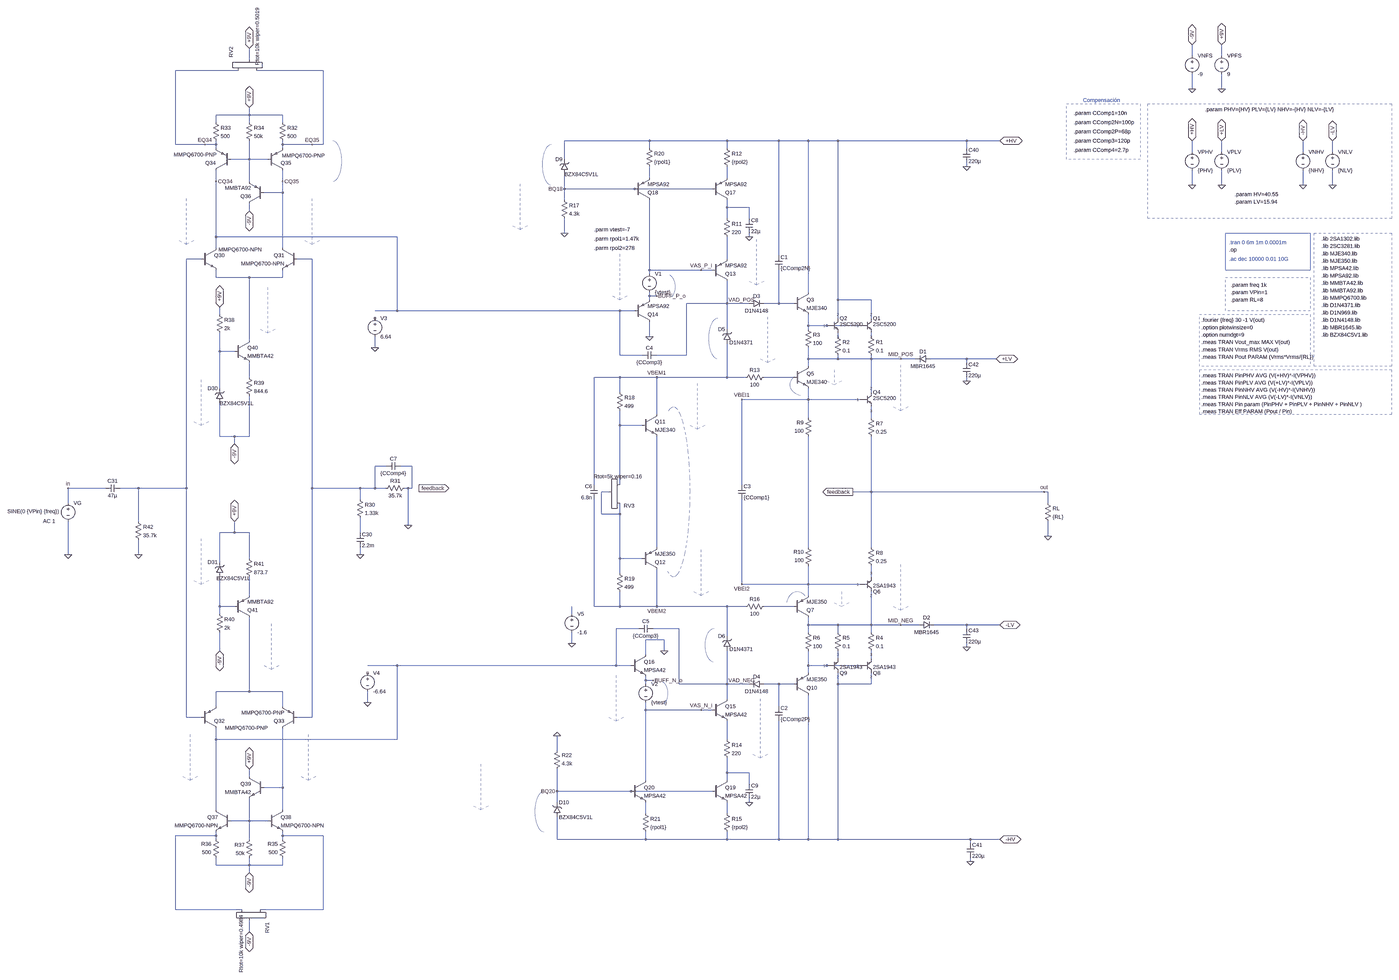
[diagram p0: schematic amplifier_V0.6_UGLY.asc, whole sheet]
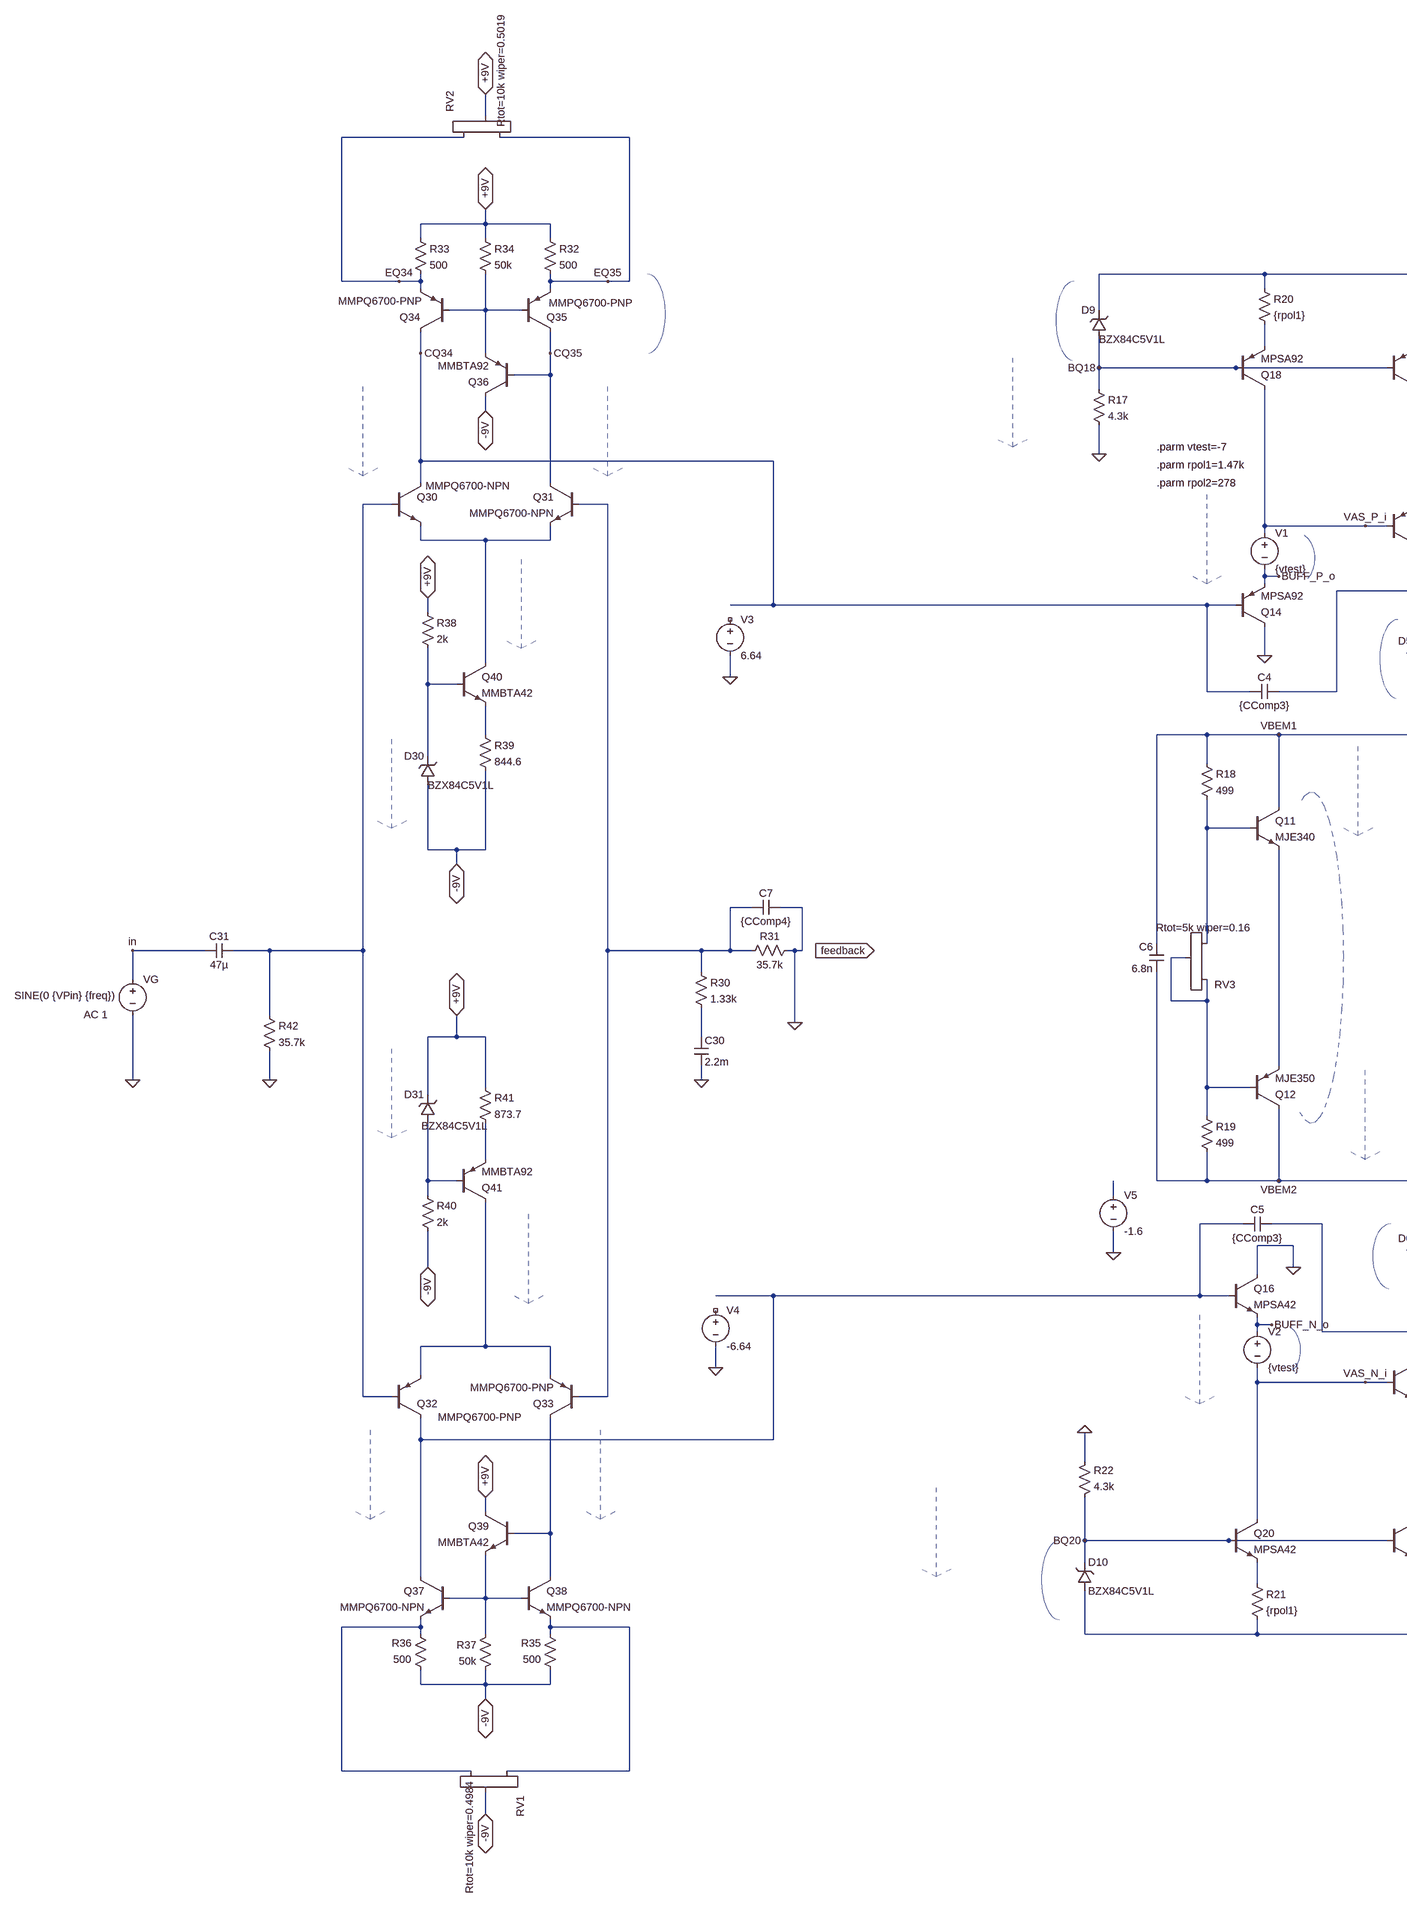
[diagram p1: schematic amplifier_V0.6_UGLY.asc, part, row 1 of 1, column 1 of 2]
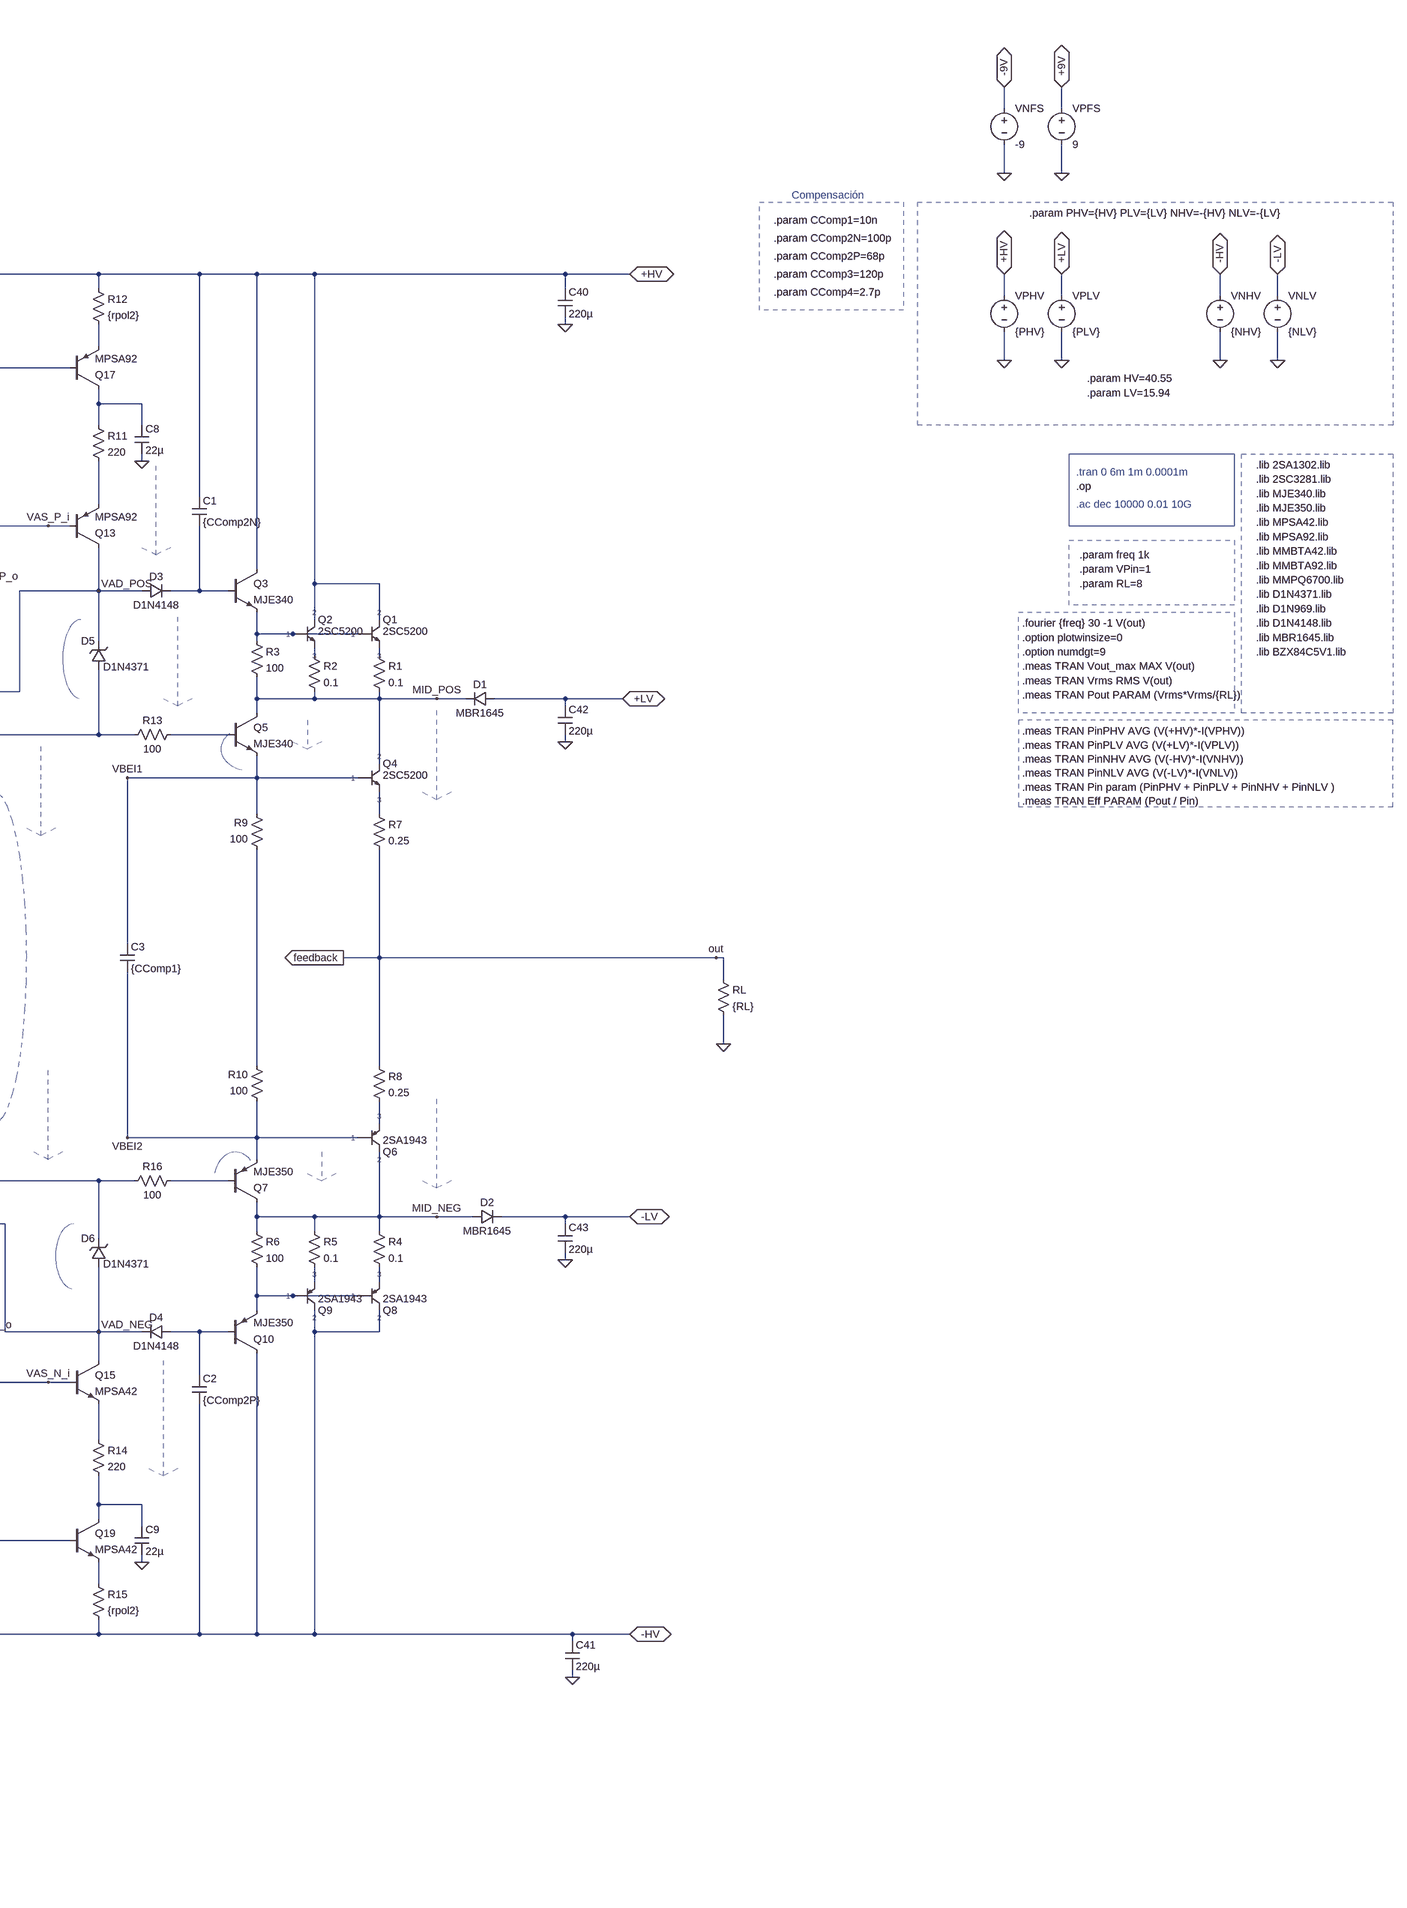
[diagram p2: schematic amplifier_V0.6_UGLY.asc, part, row 1 of 1, column 2 of 2]
amplifier_V0.6_UGLY.asc, the LTspice schematic file:
Version 4
SHEET 1 4212 2324
WIRE 1936 -1760 1936 -1808
WIRE 2064 -1760 2064 -1808
WIRE -2704 -1744 -2704 -1792
WIRE -2752 -1696 -3024 -1696
WIRE -2384 -1696 -2672 -1696
WIRE 1936 -1616 1936 -1680
WIRE 2064 -1616 2064 -1680
WIRE -2704 -1504 -2704 -1536
WIRE -2704 -1504 -2848 -1504
WIRE -2560 -1504 -2704 -1504
WIRE -2848 -1472 -2848 -1504
WIRE -2704 -1472 -2704 -1504
WIRE -2560 -1472 -2560 -1504
WIRE -640 -1392 -1008 -1392
WIRE -304 -1392 -640 -1392
WIRE -80 -1392 -304 -1392
WIRE 48 -1392 -80 -1392
WIRE 176 -1392 48 -1392
WIRE 960 -1392 176 -1392
WIRE 1104 -1392 960 -1392
WIRE -3024 -1376 -3024 -1696
WIRE -2896 -1376 -3024 -1376
WIRE -2848 -1376 -2848 -1392
WIRE -2848 -1376 -2896 -1376
WIRE -2560 -1376 -2560 -1392
WIRE -2432 -1376 -2560 -1376
WIRE -2384 -1376 -2384 -1696
WIRE -2384 -1376 -2432 -1376
WIRE -2848 -1360 -2848 -1376
WIRE -2560 -1360 -2560 -1376
WIRE -640 -1360 -640 -1392
WIRE -304 -1360 -304 -1392
WIRE 960 -1360 960 -1392
WIRE 1936 -1344 1936 -1392
WIRE 2064 -1344 2064 -1392
WIRE 2416 -1344 2416 -1392
WIRE 2544 -1344 2544 -1392
WIRE -2704 -1312 -2704 -1392
WIRE -2704 -1312 -2784 -1312
WIRE -2624 -1312 -2704 -1312
WIRE -1008 -1312 -1008 -1392
WIRE 960 -1280 960 -1296
WIRE -640 -1232 -640 -1280
WIRE -304 -1232 -304 -1280
WIRE -2848 -1216 -2848 -1264
WIRE -2704 -1216 -2704 -1312
WIRE -2560 -1216 -2560 -1264
WIRE 1936 -1200 1936 -1264
WIRE 2064 -1200 2064 -1264
WIRE 2416 -1200 2416 -1264
WIRE 2544 -1200 2544 -1264
WIRE -1008 -1184 -1008 -1248
WIRE -704 -1184 -1008 -1184
WIRE -368 -1184 -704 -1184
WIRE -2560 -1168 -2560 -1216
WIRE -2560 -1168 -2640 -1168
WIRE -1008 -1136 -1008 -1184
WIRE -304 -1104 -304 -1136
WIRE -208 -1104 -304 -1104
WIRE -2704 -1088 -2704 -1120
WIRE -304 -1056 -304 -1104
WIRE -208 -1056 -208 -1104
WIRE -1008 -992 -1008 -1056
WIRE -2848 -976 -2848 -1216
WIRE -2064 -976 -2848 -976
WIRE -208 -976 -208 -992
WIRE -2848 -928 -2848 -976
WIRE -2560 -928 -2560 -1168
WIRE -80 -896 -80 -1392
WIRE -2912 -880 -2976 -880
WIRE -2432 -880 -2496 -880
WIRE -304 -880 -304 -976
WIRE -640 -832 -640 -1136
WIRE -416 -832 -640 -832
WIRE -368 -832 -416 -832
WIRE -640 -816 -640 -832
WIRE -2848 -800 -2848 -832
WIRE -2704 -800 -2848 -800
WIRE -2560 -800 -2560 -832
WIRE -2560 -800 -2704 -800
WIRE 48 -736 48 -1392
WIRE -640 -720 -640 -736
WIRE -608 -720 -640 -720
WIRE -640 -704 -640 -720
WIRE 176 -704 176 -1392
WIRE 320 -704 176 -704
WIRE -304 -688 -304 -784
WIRE -304 -688 -480 -688
WIRE -208 -688 -304 -688
WIRE -80 -688 -80 -832
WIRE -80 -688 -144 -688
WIRE -16 -688 -80 -688
WIRE -2064 -656 -2064 -976
WIRE -2064 -656 -2160 -656
WIRE -768 -656 -2064 -656
WIRE -704 -656 -768 -656
WIRE -2832 -640 -2832 -672
WIRE 176 -624 176 -704
WIRE 320 -624 320 -704
WIRE 48 -592 48 -640
WIRE 128 -592 48 -592
WIRE 272 -592 128 -592
WIRE -304 -576 -304 -688
WIRE 48 -576 48 -592
WIRE -640 -544 -640 -608
WIRE 176 -544 176 -560
WIRE 320 -544 320 -560
WIRE -2704 -528 -2704 -800
WIRE -2160 -496 -2160 -544
WIRE -2832 -480 -2832 -560
WIRE -2768 -480 -2832 -480
WIRE -768 -464 -768 -656
WIRE -672 -464 -768 -464
WIRE -480 -464 -480 -688
WIRE -480 -464 -608 -464
WIRE 48 -448 48 -496
WIRE 176 -448 176 -464
WIRE 176 -448 48 -448
WIRE 320 -448 320 -464
WIRE 320 -448 176 -448
WIRE 448 -448 320 -448
WIRE 512 -448 448 -448
WIRE 960 -448 576 -448
WIRE 1088 -448 960 -448
WIRE 960 -432 960 -448
WIRE 48 -416 48 -448
WIRE -2704 -368 -2704 -432
WIRE -768 -368 -880 -368
WIRE -608 -368 -768 -368
WIRE -304 -368 -304 -512
WIRE -304 -368 -608 -368
WIRE -224 -368 -304 -368
WIRE -16 -368 -144 -368
WIRE 960 -352 960 -368
WIRE -2832 -320 -2832 -480
WIRE -768 -304 -768 -368
WIRE 320 -304 320 -448
WIRE 48 -272 48 -320
WIRE 48 -272 -240 -272
WIRE 272 -272 48 -272
WIRE -608 -208 -608 -368
WIRE 48 -192 48 -272
WIRE 320 -192 320 -240
WIRE -768 -160 -768 -224
WIRE -672 -160 -768 -160
WIRE -2832 -112 -2832 -256
WIRE -2768 -112 -2832 -112
WIRE -2704 -112 -2704 -288
WIRE -2704 -112 -2768 -112
WIRE -2768 -80 -2768 -112
WIRE -2112 16 -2160 16
WIRE -2000 16 -2048 16
WIRE -880 96 -880 -368
WIRE -768 96 -768 -160
WIRE -240 96 -240 -272
WIRE -3328 112 -3600 112
WIRE -3184 112 -3264 112
WIRE -2976 112 -2976 -880
WIRE -2976 112 -3184 112
WIRE -2432 112 -2432 -880
WIRE -2224 112 -2432 112
WIRE -2160 112 -2160 16
WIRE -2160 112 -2224 112
WIRE -2112 112 -2160 112
WIRE -2016 112 -2032 112
WIRE -2000 112 -2000 16
WIRE -2000 112 -2016 112
WIRE -816 128 -848 128
WIRE 320 128 320 -112
WIRE 320 128 240 128
WIRE 1296 128 320 128
WIRE 1312 128 1296 128
WIRE -2224 160 -2224 112
WIRE -3600 176 -3600 112
WIRE 1312 176 1312 128
WIRE -848 224 -848 128
WIRE -768 224 -768 176
WIRE -768 224 -848 224
WIRE -3184 256 -3184 112
WIRE -2016 272 -2016 112
WIRE -2768 304 -2768 256
WIRE -2768 304 -2832 304
WIRE -2704 304 -2768 304
WIRE -2224 304 -2224 240
WIRE 1312 320 1312 256
WIRE -608 368 -608 -112
WIRE 48 368 48 -112
WIRE 320 368 320 128
WIRE -3600 400 -3600 256
WIRE -3184 400 -3184 336
WIRE -2224 400 -2224 368
WIRE -2704 416 -2704 304
WIRE -768 416 -768 224
WIRE -672 416 -768 416
WIRE -2832 432 -2832 304
WIRE -768 480 -768 416
WIRE 320 496 320 448
WIRE -240 528 -240 160
WIRE 48 528 48 448
WIRE 48 528 -240 528
WIRE 272 528 48 528
WIRE -2704 576 -2704 496
WIRE 48 576 48 528
WIRE -2832 624 -2832 496
WIRE -2768 624 -2832 624
WIRE -880 624 -880 160
WIRE -768 624 -768 560
WIRE -768 624 -880 624
WIRE -608 624 -608 464
WIRE -608 624 -768 624
WIRE -304 624 -608 624
WIRE -224 624 -304 624
WIRE -16 624 -144 624
WIRE -2832 656 -2832 624
WIRE -976 656 -976 624
WIRE 48 704 48 672
WIRE 176 704 48 704
WIRE 320 704 320 560
WIRE 320 704 176 704
WIRE 448 704 320 704
WIRE 528 704 448 704
WIRE 960 704 592 704
WIRE 1104 704 960 704
WIRE -688 720 -784 720
WIRE -512 720 -624 720
WIRE 960 720 960 704
WIRE 48 736 48 704
WIRE 176 736 176 704
WIRE 320 736 320 704
WIRE -304 752 -304 624
WIRE -576 768 -656 768
WIRE -976 784 -976 736
WIRE 960 800 960 784
WIRE -2832 816 -2832 736
WIRE -576 816 -576 768
WIRE -656 832 -656 768
WIRE 176 848 176 816
WIRE 320 848 320 816
WIRE -2064 880 -2192 880
WIRE -784 880 -784 720
WIRE -784 880 -2064 880
WIRE -720 880 -784 880
WIRE 48 880 48 816
WIRE 128 880 48 880
WIRE 272 880 128 880
WIRE 48 912 48 880
WIRE -656 944 -656 928
WIRE -624 944 -656 944
WIRE -656 960 -656 944
WIRE -512 960 -512 720
WIRE -304 960 -304 816
WIRE -304 960 -512 960
WIRE -208 960 -304 960
WIRE -80 960 -144 960
WIRE -16 960 -80 960
WIRE 176 960 176 912
WIRE 320 960 320 912
WIRE 320 960 176 960
WIRE -2704 992 -2704 672
WIRE -2704 992 -2848 992
WIRE -2560 992 -2704 992
WIRE -304 1024 -304 960
WIRE -2192 1040 -2192 992
WIRE -2848 1056 -2848 992
WIRE -2560 1056 -2560 992
WIRE -80 1056 -80 960
WIRE -656 1072 -656 1040
WIRE -416 1072 -656 1072
WIRE -368 1072 -416 1072
WIRE -2976 1104 -2976 112
WIRE -2912 1104 -2976 1104
WIRE -2432 1104 -2432 112
WIRE -2432 1104 -2496 1104
WIRE -2848 1200 -2848 1152
WIRE -2064 1200 -2064 880
WIRE -2064 1200 -2848 1200
WIRE -304 1200 -304 1120
WIRE -1040 1248 -1040 1184
WIRE -304 1344 -304 1280
WIRE -208 1344 -304 1344
WIRE -2704 1360 -2704 1328
WIRE -656 1376 -656 1072
WIRE -304 1376 -304 1344
WIRE -208 1392 -208 1344
WIRE -2560 1408 -2560 1152
WIRE -2560 1408 -2640 1408
WIRE -1040 1424 -1040 1328
WIRE -720 1424 -1040 1424
WIRE -368 1424 -720 1424
WIRE -1040 1472 -1040 1424
WIRE -208 1472 -208 1456
WIRE -2848 1504 -2848 1200
WIRE -2560 1504 -2560 1408
WIRE -656 1520 -656 1472
WIRE -304 1520 -304 1472
WIRE -2704 1552 -2704 1456
WIRE -2704 1552 -2784 1552
WIRE -2624 1552 -2704 1552
WIRE -2848 1616 -2848 1600
WIRE -2848 1616 -3024 1616
WIRE -2560 1616 -2560 1600
WIRE -2384 1616 -2560 1616
WIRE -2848 1632 -2848 1616
WIRE -2704 1632 -2704 1552
WIRE -2560 1632 -2560 1616
WIRE -1040 1632 -1040 1536
WIRE -656 1632 -656 1600
WIRE -656 1632 -1040 1632
WIRE -304 1632 -304 1600
WIRE -304 1632 -656 1632
WIRE -80 1632 -80 1120
WIRE -80 1632 -304 1632
WIRE 48 1632 48 1008
WIRE 48 1632 -80 1632
WIRE 176 1632 176 960
WIRE 176 1632 48 1632
WIRE 976 1632 176 1632
WIRE 1104 1632 976 1632
WIRE 976 1648 976 1632
WIRE 976 1728 976 1712
WIRE -2848 1744 -2848 1712
WIRE -2704 1744 -2704 1712
WIRE -2704 1744 -2848 1744
WIRE -2560 1744 -2560 1712
WIRE -2560 1744 -2704 1744
WIRE -2704 1776 -2704 1744
WIRE -3024 1936 -3024 1616
WIRE -2736 1936 -3024 1936
WIRE -2384 1936 -2384 1616
WIRE -2384 1936 -2656 1936
WIRE -2704 2032 -2704 1984
FLAG -608 -368 VBEM1
FLAG -608 624 VBEM2
FLAG -304 -688 VAD_POS
FLAG -304 960 VAD_NEG
FLAG 448 704 MID_NEG
FLAG 448 -448 MID_POS
FLAG -240 -272 VBEI1
FLAG -240 528 VBEI2
FLAG -3184 400 0
FLAG -2224 400 0
FLAG -640 -544 0
FLAG -576 816 0
FLAG -2704 -1536 +9V
IOPIN -2704 -1536 BiDir
FLAG -2704 1776 -9V
IOPIN -2704 1776 BiDir
FLAG -2704 1328 +9V
IOPIN -2704 1328 BiDir
FLAG -2704 -1088 -9V
IOPIN -2704 -1088 BiDir
FLAG -2832 -672 +9V
IOPIN -2832 -672 BiDir
FLAG -2768 -80 -9V
IOPIN -2768 -80 BiDir
FLAG -2768 256 +9V
IOPIN -2768 256 BiDir
FLAG -2832 816 -9V
IOPIN -2832 816 BiDir
FLAG 1104 1632 -HV
IOPIN 1104 1632 BiDir
FLAG 1104 704 -LV
IOPIN 1104 704 BiDir
FLAG 1104 -1392 +HV
IOPIN 1104 -1392 BiDir
FLAG 1088 -448 +LV
IOPIN 1088 -448 BiDir
FLAG 1312 320 0
FLAG 1296 128 out
FLAG -1840 112 feedback
IOPIN -1840 112 In
FLAG 240 128 feedback
IOPIN 240 128 Out
FLAG -3600 400 0
FLAG -3600 112 in
FLAG -416 -832 VAS_P_i
FLAG -608 -720 BUFF_P_o
FLAG -416 1072 VAS_N_i
FLAG -624 944 BUFF_N_o
FLAG 960 -1280 0
FLAG 960 -352 0
FLAG 960 800 0
FLAG 976 1728 0
FLAG 1936 -1200 0
FLAG 2064 -1200 0
FLAG 2416 -1200 0
FLAG 2544 -1200 0
FLAG 1936 -1392 +HV
IOPIN 1936 -1392 BiDir
FLAG 2064 -1392 +LV
IOPIN 2064 -1392 BiDir
FLAG 2416 -1392 -HV
IOPIN 2416 -1392 BiDir
FLAG 2544 -1392 -LV
IOPIN 2544 -1392 BiDir
FLAG -2704 -1792 +9V
IOPIN -2704 -1792 BiDir
FLAG -2704 2032 -9V
IOPIN -2704 2032 BiDir
FLAG -2560 -1216 CQ35
FLAG -2432 -1376 EQ35
FLAG -2896 -1376 EQ34
FLAG -2848 -1216 CQ34
FLAG -1008 -992 0
FLAG -208 -976 0
FLAG -1040 1184 0
FLAG 1936 -1616 0
FLAG 2064 -1616 0
FLAG 1936 -1808 -9V
IOPIN 1936 -1808 BiDir
FLAG 2064 -1808 +9V
IOPIN 2064 -1808 BiDir
FLAG -2016 272 0
FLAG -2160 -496 0
FLAG -2192 1040 0
FLAG -1008 -1184 BQ18
FLAG -1040 1424 BQ20
FLAG -976 784 0
FLAG -208 1472 0
DATAFLAG 96 704 "round($*100)/100"
DATAFLAG 448 -304 "Ix(q4:2)"
DATAFLAG 448 560 "-Ix(q6:2)"
DATAFLAG -464 128 "V(vbem1)-V(vbem2)"
DATAFLAG 160 -368 "-Ie(Q5)"
DATAFLAG 192 592 "Ie(Q7)"
DATAFLAG -384 -496 "V(vad_pos)-V(vbem1)"
DATAFLAG -400 784 "-(V(vad_neg)-V(vbem2))"
DATAFLAG -16 -304 "V(vbem1)-V(vbei1)"
DATAFLAG -32 576 "-(V(vbem2)-V(vbei2))"
DATAFLAG -448 624 ""
DATAFLAG -464 -368 ""
DATAFLAG -176 -864 "Ie(Q13)"
DATAFLAG -160 1136 "Ic(Q15)"
DATAFLAG -768 -800 "Ie(Q14)"
DATAFLAG -528 1072 ""
DATAFLAG -1648 -656 ""
DATAFLAG -1648 880 ""
DATAFLAG -416 -688 ""
DATAFLAG -2432 -1040 "Ic(Q31)"
DATAFLAG -2976 -1040 "Ic(Q30)"
DATAFLAG -2704 -800 ""
DATAFLAG -2960 1280 "-Ic(Q32)"
DATAFLAG -2704 992 ""
DATAFLAG -2848 1312 ""
DATAFLAG -2448 1280 "-Ic(Q33)"
DATAFLAG -2560 1328 ""
DATAFLAG -2848 -1056 ""
DATAFLAG -2560 -1056 ""
DATAFLAG -2688 -1312 ""
DATAFLAG 1200 128 ""
DATAFLAG -2832 -496 ""
DATAFLAG -2704 -416 ""
DATAFLAG -528 -832 ""
DATAFLAG 48 144 ""
DATAFLAG -2272 112 ""
DATAFLAG -560 1008 "V(VAS_P_i)-V(BUFF_P_o)"
DATAFLAG -528 -768 "V(VAS_P_i)-V(BUFF_P_o)"
DATAFLAG -2624 -656 "Ic(Q40)"
DATAFLAG -2608 800 "-Ic(Q41)"
DATAFLAG 48 -592 ""
DATAFLAG -304 1168 ""
DATAFLAG -80 960 ""
DATAFLAG -784 1008 "-Ie(Q16)"
DATAFLAG -608 80 ""
DATAFLAG -2912 -256 "Ix(D30:-)"
DATAFLAG -2912 432 "Ix(D31:-)"
DATAFLAG -2816 624 ""
DATAFLAG -1376 1408 "-I(R22)"
DATAFLAG -1936 112 ""
DATAFLAG -2304 -1264 "V(EQ35)-V(CQ35)"
DATAFLAG -896 -1184 ""
DATAFLAG -1104 -1248 "V(+hv)-V(BQ18)"
DATAFLAG -640 -1248 ""
DATAFLAG -304 -1264 ""
DATAFLAG -128 -1280 "Ie(Q17)"
DATAFLAG -896 -1312 "V(+hv)-V(n004)"
DATAFLAG -2928 -400 "V(n014)-V(-lv)"
DATAFLAG -448 -1232 "Ib(Q17)"
DATAFLAG -784 -1232 "Ib(Q18)"
DATAFLAG -240 -1104 ""
DATAFLAG -448 -880 "Ib(Q13)"
DATAFLAG -304 -928 ""
DATAFLAG -448 -1184 ""
DATAFLAG -416 960 ""
DATAFLAG -1136 1472 "-V(-hv)+V(BQ20)"
DATAFLAG -912 1424 ""
DATAFLAG -2592 -1504 ""
DATAFLAG 2064 -1776 ""
DATAFLAG -496 1280 "Ic(Q20)"
DATAFLAG -2720 -112 ""
DATAFLAG -2736 304 ""
DATAFLAG -2832 784 ""
DATAFLAG -128 -528 "-I(D5)"
DATAFLAG -432 -240 "Ic(Q11)"
DATAFLAG -416 480 "-Ic(Q12)"
DATAFLAG -1200 -1104 "I(R17)"
DATAFLAG -256 1344 ""
SYMBOL npn -16 -736 R0
SYMATTR InstName Q3
SYMATTR Value MJE340
SYMBOL res 32 -592 R0
SYMATTR InstName R3
SYMATTR Value 100
SYMBOL diode -208 -672 R270
WINDOW 0 32 32 VTop 2
WINDOW 3 0 32 VBottom 2
SYMATTR InstName D3
SYMATTR Value D1N4148
SYMBOL npn -16 -416 R0
SYMATTR InstName Q5
SYMATTR Value MJE340
SYMBOL res 304 -208 R0
SYMATTR InstName R7
SYMATTR Value 0.25
SYMBOL res 64 -96 R180
WINDOW 0 36 76 Left 2
WINDOW 3 36 40 Left 2
SYMATTR InstName R9
SYMATTR Value 100
SYMBOL res 304 352 R0
SYMATTR InstName R8
SYMATTR Value 0.25
SYMBOL pnp -16 672 M180
SYMATTR InstName Q7
SYMATTR Value MJE350
SYMBOL pnp -16 1008 M180
SYMATTR InstName Q10
SYMATTR Value MJE350
SYMBOL res 32 720 R0
SYMATTR InstName R6
SYMATTR Value 100
SYMBOL diode -144 944 R90
WINDOW 0 0 32 VBottom 2
WINDOW 3 32 32 VTop 2
SYMATTR InstName D4
SYMATTR Value D1N4148
SYMBOL diode 528 720 R270
WINDOW 0 32 32 VTop 2
WINDOW 3 0 32 VBottom 2
SYMATTR InstName D2
SYMATTR Value MBR1645
SYMBOL res 64 464 R180
WINDOW 0 36 76 Left 2
WINDOW 3 36 40 Left 2
SYMATTR InstName R10
SYMATTR Value 100
SYMBOL res 304 720 R0
SYMATTR InstName R4
SYMATTR Value 0.1
SYMBOL res 160 720 R0
SYMATTR InstName R5
SYMATTR Value 0.1
SYMBOL res 160 -560 R0
SYMATTR InstName R2
SYMATTR Value 0.1
SYMBOL res 304 -560 R0
SYMATTR InstName R1
SYMATTR Value 0.1
SYMBOL diode 576 -432 M270
WINDOW 0 32 32 VTop 2
WINDOW 3 0 32 VBottom 2
SYMATTR InstName D1
SYMATTR Value MBR1645
SYMBOL pnp -672 464 M180
SYMATTR InstName Q12
SYMATTR Value MJE350
SYMBOL npn -672 -208 R0
SYMATTR InstName Q11
SYMATTR Value MJE340
SYMBOL res -784 -320 R0
SYMATTR InstName R18
SYMATTR Value 499
SYMBOL res -784 464 R0
SYMATTR InstName R19
SYMATTR Value 499
SYMBOL cap -256 96 R0
SYMATTR InstName C3
SYMATTR Value {CComp1}
SYMBOL res -128 -384 R90
WINDOW 0 0 56 VBottom 2
WINDOW 3 32 56 VTop 2
SYMATTR InstName R13
SYMATTR Value 100
SYMBOL res -128 608 R90
WINDOW 0 0 56 VBottom 2
WINDOW 3 32 56 VTop 2
SYMATTR InstName R16
SYMATTR Value 100
SYMBOL pnp -368 -784 M180
SYMATTR InstName Q13
SYMATTR Value MPSA92
SYMBOL npn -368 1024 R0
SYMATTR InstName Q15
SYMATTR Value MPSA42
SYMBOL cap -864 96 M0
SYMATTR InstName C6
SYMATTR Value 6.8n
SYMBOL npn -720 832 R0
SYMATTR InstName Q16
SYMATTR Value MPSA42
SYMBOL res -2240 144 R0
SYMATTR InstName R30
SYMATTR Value 1.33k
SYMBOL res -2016 96 R90
WINDOW 0 0 56 VBottom 2
WINDOW 3 32 56 VTop 2
SYMATTR InstName R31
SYMATTR Value 35.7k
SYMBOL res -3200 240 R0
SYMATTR InstName R42
SYMATTR Value 35.7k
SYMBOL cap -2240 304 R0
SYMATTR InstName C30
SYMATTR Value 2.2m
SYMBOL cap -3264 96 R90
WINDOW 0 0 32 VBottom 2
WINDOW 3 32 32 VTop 2
SYMATTR InstName C31
SYMATTR Value 47µ
SYMBOL pnp -704 -608 M180
SYMATTR InstName Q14
SYMATTR Value MPSA92
SYMBOL npn -2912 -928 R0
WINDOW 3 75 7 Left 2
SYMATTR Value MMPQ6700-NPN
SYMATTR InstName Q30
SYMBOL npn -2496 -928 M0
SYMATTR InstName Q31
SYMATTR Value MMPQ6700-NPN
SYMBOL pnp -2912 1152 M180
WINDOW 3 102 2 Left 2
SYMATTR Value MMPQ6700-PNP
SYMATTR InstName Q32
SYMBOL pnp -2496 1152 R180
SYMATTR InstName Q33
SYMATTR Value MMPQ6700-PNP
SYMBOL cap -608 -480 R90
WINDOW 0 0 32 VBottom 2
WINDOW 3 32 32 VTop 2
SYMATTR InstName C4
SYMATTR Value {CComp3}
SYMBOL cap -624 704 R90
WINDOW 0 0 32 VBottom 2
WINDOW 3 32 32 VTop 2
SYMATTR InstName C5
SYMATTR Value {CComp3}
SYMBOL pnp -2624 -1264 M180
WINDOW 3 61 64 Left 2
SYMATTR Value MMPQ6700-PNP
SYMATTR InstName Q35
SYMBOL pnp -2784 -1264 R180
WINDOW 0 65 32 Left 2
WINDOW 3 61 68 Left 2
SYMATTR InstName Q34
SYMATTR Value MMPQ6700-PNP
SYMBOL npn -2784 1504 M0
SYMATTR InstName Q37
SYMATTR Value MMPQ6700-NPN
SYMBOL npn -2624 1504 R0
SYMATTR InstName Q38
SYMATTR Value MMPQ6700-NPN
SYMBOL res -2864 -1488 R0
SYMATTR InstName R33
SYMATTR Value 500
SYMBOL res -2576 -1488 R0
SYMATTR InstName R32
SYMATTR Value 500
SYMBOL res -2544 1728 R180
WINDOW 0 36 76 Left 2
WINDOW 3 36 40 Left 2
SYMATTR InstName R35
SYMATTR Value 500
SYMBOL res -2832 1728 R180
WINDOW 0 36 76 Left 2
WINDOW 3 36 40 Left 2
SYMATTR InstName R36
SYMATTR Value 500
SYMBOL npn -2640 1360 M0
SYMATTR InstName Q39
SYMATTR Value MMBTA42
SYMBOL pnp -2640 -1120 R180
SYMATTR InstName Q36
SYMATTR Value MMBTA92
SYMBOL res -2688 1616 M0
SYMATTR InstName R37
SYMATTR Value 50k
SYMBOL res -2720 -1488 R0
SYMATTR InstName R34
SYMATTR Value 50k
SYMBOL 2SC5200 144 -608 R0
SYMATTR InstName Q2
SYMBOL 2SC5200 288 -608 R0
SYMATTR InstName Q1
SYMBOL 2SC5200 288 -288 R0
SYMATTR InstName Q4
SYMBOL 2SA1943 288 544 M180
SYMATTR InstName Q6
SYMBOL 2SA1943 144 896 M180
SYMATTR InstName Q9
SYMBOL 2SA1943 288 896 M180
SYMATTR InstName Q8
SYMBOL res -2848 -656 R0
SYMATTR InstName R38
SYMATTR Value 2k
SYMBOL npn -2768 -528 R0
SYMATTR InstName Q40
SYMATTR Value MMBTA42
SYMBOL res -2720 -384 R0
SYMATTR InstName R39
SYMATTR Value 844.6
SYMBOL pnp -2768 672 M180
SYMATTR InstName Q41
SYMATTR Value MMBTA92
SYMBOL res -2720 400 R0
SYMATTR InstName R41
SYMATTR Value 873.7
SYMBOL res -2848 640 R0
SYMATTR InstName R40
SYMATTR Value 2k
SYMBOL res 1296 160 R0
SYMATTR InstName RL
SYMATTR Value {RL}
SYMBOL cap -96 1056 R0
SYMATTR InstName C2
SYMATTR Value {CComp2P}
SYMBOL cap -96 -896 R0
SYMATTR InstName C1
SYMATTR Value {CComp2N}
SYMBOL voltage -3600 160 R0
WINDOW 3 -263 52 Left 2
WINDOW 123 -109 95 Left 2
WINDOW 39 0 0 Left 2
SYMATTR Value SINE(0 {VPin} {freq})
SYMATTR Value2 AC 1
SYMATTR InstName VG
SYMBOL zener -288 -512 R180
WINDOW 0 24 64 Left 2
WINDOW 3 -96 7 Left 2
SYMATTR InstName D5
SYMATTR Value D1N4371
SYMBOL zener -288 816 R180
WINDOW 0 24 64 Left 2
WINDOW 3 -96 7 Left 2
SYMATTR InstName D6
SYMATTR Value D1N4371
SYMBOL cap 944 -1360 R0
SYMATTR InstName C40
SYMATTR Value 220µ
SYMBOL cap 944 -432 R0
SYMATTR InstName C42
SYMATTR Value 220µ
SYMBOL cap 944 720 R0
SYMATTR InstName C43
SYMATTR Value 220µ
SYMBOL cap 960 1648 R0
SYMATTR InstName C41
SYMATTR Value 220µ
SYMBOL zener -2816 -256 R180
WINDOW 0 24 64 Left 2
WINDOW 3 -131 -1 Left 2
SYMATTR InstName D30
SYMATTR Value BZX84C5V1L
SYMATTR Prefix X
SYMBOL zener -2816 496 R180
WINDOW 0 24 64 Left 2
WINDOW 3 -117 -6 Left 2
SYMATTR InstName D31
SYMATTR Value BZX84C5V1L
SYMATTR Prefix X
SYMBOL voltage 1936 -1360 R0
SYMATTR InstName VPHV
SYMATTR Value {PHV}
SYMBOL voltage 2064 -1360 R0
SYMATTR InstName VPLV
SYMATTR Value {PLV}
SYMBOL voltage 2416 -1360 R0
SYMATTR InstName VNHV
SYMATTR Value {NHV}
SYMBOL voltage 2544 -1360 R0
SYMATTR InstName VNLV
SYMATTR Value {NLV}
SYMBOL potentiometer_standard -2640 1920 R90
WINDOW 3 39 99 Left 2
SYMATTR Value Rtot=10k wiper=0.4984
SYMATTR InstName RV1
SYMATTR SpiceLine ""
SYMBOL potentiometer_standard -2768 -1680 R270
WINDOW 3 39 99 Left 2
SYMATTR Value Rtot=10k wiper=0.5019
SYMATTR InstName RV2
SYMATTR SpiceLine ""
SYMBOL cap -2048 0 R90
WINDOW 0 0 32 VBottom 2
WINDOW 3 32 32 VTop 2
SYMATTR InstName C7
SYMATTR Value {CComp4}
SYMBOL pnp -704 -1136 M180
SYMATTR InstName Q18
SYMATTR Value MPSA92
SYMBOL pnp -368 -1136 M180
SYMATTR InstName Q17
SYMATTR Value MPSA92
SYMBOL res -320 -1072 R0
SYMATTR InstName R11
SYMATTR Value 220
SYMBOL res -320 -1376 R0
SYMATTR InstName R12
SYMATTR Value {rpol2}
SYMBOL res -656 -1376 R0
SYMATTR InstName R20
SYMATTR Value {rpol1}
SYMBOL potentiometer_standard -752 192 R180
WINDOW 3 -81 131 Left 2
WINDOW 0 -47 4 Left 2
WINDOW 38 -77 35 Left 2
SYMATTR Value Rtot=5k wiper=0.16
SYMATTR InstName RV3
SYMATTR SpiceLine ""
SYMBOL res -1024 -1152 R0
SYMATTR InstName R17
SYMATTR Value 4.3k
SYMBOL zener -992 -1248 R180
WINDOW 0 24 64 Left 2
WINDOW 3 -131 -1 Left 2
SYMATTR InstName D9
SYMATTR Value BZX84C5V1L
SYMATTR Prefix X
SYMBOL cap -224 -1056 R0
SYMATTR InstName C8
SYMATTR Value 22µ
SYMBOL res -320 1184 R0
SYMATTR InstName R14
SYMATTR Value 220
SYMBOL npn -368 1376 R0
SYMATTR InstName Q19
SYMATTR Value MPSA42
SYMBOL res -320 1504 R0
SYMATTR InstName R15
SYMATTR Value {rpol2}
SYMBOL npn -720 1376 R0
SYMATTR InstName Q20
SYMATTR Value MPSA42
SYMBOL res -672 1504 R0
SYMATTR InstName R21
SYMATTR Value {rpol1}
SYMBOL res -1056 1344 M180
WINDOW 0 36 76 Left 2
WINDOW 3 36 40 Left 2
SYMATTR InstName R22
SYMATTR Value 4.3k
SYMBOL zener -1056 1536 M180
WINDOW 0 24 64 Left 2
WINDOW 3 24 0 Left 2
SYMATTR InstName D10
SYMATTR Value BZX84C5V1L
SYMATTR Prefix X
SYMBOL voltage 1936 -1776 R0
SYMATTR InstName VNFS
SYMATTR Value -9
SYMBOL voltage 2064 -1776 R0
SYMATTR InstName VPFS
SYMATTR Value 9
SYMBOL voltage -640 -832 R0
SYMATTR InstName V1
SYMATTR Value {vtest}
SYMBOL voltage -656 944 R0
SYMATTR InstName V2
SYMATTR Value {vtest}
SYMBOL voltage -2160 -640 R0
SYMATTR InstName V3
SYMATTR Value 6.64
SYMBOL voltage -2192 896 R0
SYMATTR InstName V4
SYMATTR Value -6.64
SYMBOL voltage -976 640 R0
SYMATTR InstName V5
SYMATTR Value -1.6
SYMBOL cap -224 1392 R0
SYMATTR InstName C9
SYMATTR Value 22µ
TEXT 2096 -952 Left 2 ;.tran 0 6m 1m 0.0001m
TEXT 2104 -768 Left 2 !.param freq 1k
TEXT 2096 -920 Left 2 !.op
TEXT 1976 -616 Left 2 !.fourier {freq} 30 -1 V(out)
TEXT 2496 -968 Left 2 !.lib 2SA1302.lib
TEXT 2496 -936 Left 2 !.lib 2SC3281.lib
TEXT 2496 -680 Left 2 !.lib D1N4371.lib
TEXT 2496 -584 Left 2 !.lib MBR1645.lib
TEXT 2496 -904 Left 2 !.lib MJE340.lib
TEXT 2496 -872 Left 2 !.lib MJE350.lib
TEXT 2496 -616 Left 2 !.lib D1N4148.lib
TEXT 2496 -840 Left 2 !.lib MPSA42.lib
TEXT 2496 -808 Left 2 !.lib MPSA92.lib
TEXT 2496 -648 Left 2 !.lib D1N969.lib
TEXT 2096 -880 Left 2 ;.ac dec 10000 0.01 10G
TEXT 2104 -736 Left 2 !.param VPin=1
TEXT 2496 -552 Left 2 !.lib BZX84C5V1.lib
TEXT 2496 -776 Left 2 !.lib MMBTA42.lib
TEXT 2496 -744 Left 2 !.lib MMBTA92.lib
TEXT 2496 -712 Left 2 !.lib MMPQ6700.lib
TEXT 1976 -584 Left 2 !.option plotwinsize=0
TEXT 1976 -488 Left 2 !.meas TRAN Vrms RMS V(out)
TEXT 1976 -456 Left 2 !.meas TRAN Pout PARAM (Vrms*Vrms/{RL})
TEXT 1976 -552 Left 2 !.option numdgt=9
TEXT 1976 -520 Left 2 !.meas TRAN Vout_max MAX V(out)
TEXT 2104 -704 Left 2 !.param RL=8
TEXT 1976 -376 Left 2 !.meas TRAN PinPHV AVG (V(+HV)*-I(VPHV))\n.meas TRAN PinPLV AVG (V(+LV)*-I(VPLV))\n.meas TRAN PinNHV AVG (V(-HV)*-I(VNHV))\n.meas TRAN PinNLV AVG (V(-LV)*-I(VNLV))\n.meas TRAN Pin param (PinPHV + PinPLV + PinNHV + PinNLV )\n.meas TRAN Eff PARAM (Pout / Pin)
TEXT 1992 -1528 Left 2 !.param PHV={HV} PLV={LV} NHV=-{HV} NLV=-{LV}
TEXT 2120 -1160 Left 2 !.param HV=40.55
TEXT 2120 -1128 Left 2 !.param LV=15.94
TEXT 1424 -1512 Left 2 !.param CComp1=10n
TEXT 1424 -1472 Left 2 !.param CComp2N=100p
TEXT 1424 -1392 Left 2 !.param CComp3=120p
TEXT 1464 -1568 Left 2 ;Compensación
TEXT 1424 -1432 Left 2 !.param CComp2P=68p
TEXT 1424 -1352 Left 2 !.param CComp4=2.7p
TEXT -880 -1008 Left 2 !.parm vtest=-7
TEXT -880 -968 Left 2 !.parm rpol1=1.47k
TEXT -880 -928 Left 2 !.parm rpol2=278
LINE Normal -768 -704 -768 -912 2
LINE Normal 448 -224 448 -432 2
LINE Normal 480 -240 448 -224 2
LINE Normal 416 -240 448 -224 2
LINE Normal 448 640 448 432 2
LINE Normal 480 624 448 640 2
LINE Normal 416 624 448 640 2
LINE Normal -144 -784 -176 -768 2
LINE Normal -208 -784 -176 -768 2
LINE Normal -160 1280 -160 1024 2
LINE Normal 192 -352 160 -336 2
LINE Normal 128 -352 160 -336 2
LINE Normal 160 -400 160 -336 2
LINE Normal 224 608 192 624 2
LINE Normal 160 608 192 624 2
LINE Normal 192 560 192 624 2
LINE Normal -2432 -944 -2432 -1152 2
LINE Normal -2400 -960 -2432 -944 2
LINE Normal -2464 -960 -2432 -944 2
LINE Normal -2976 -944 -2976 -1152 2
LINE Normal -2944 -960 -2976 -944 2
LINE Normal -3008 -960 -2976 -944 2
LINE Normal -2960 1376 -2960 1168 2
LINE Normal -2928 1360 -2960 1376 2
LINE Normal -2992 1360 -2960 1376 2
LINE Normal -2448 1376 -2448 1168 2
LINE Normal -2416 1360 -2448 1376 2
LINE Normal -2480 1360 -2448 1376 2
LINE Normal -800 -720 -768 -704 2
LINE Normal -736 -720 -768 -704 2
LINE Normal -2624 -560 -2624 -768 2
LINE Normal -2656 -576 -2624 -560 2
LINE Normal -2592 -576 -2624 -560 2
LINE Normal -2608 896 -2608 688 2
LINE Normal -2640 880 -2608 896 2
LINE Normal -2576 880 -2608 896 2
LINE Normal -176 -768 -176 -976 2
LINE Normal -128 1264 -160 1280 2
LINE Normal -192 1264 -160 1280 2
LINE Normal -784 1120 -784 912 2
LINE Normal -752 1104 -784 1120 2
LINE Normal -816 1104 -784 1120 2
LINE Normal -2912 -160 -2912 -368 2
LINE Normal -2944 -176 -2912 -160 2
LINE Normal -2880 -176 -2912 -160 2
LINE Normal -2912 528 -2912 320 2
LINE Normal -2944 512 -2912 528 2
LINE Normal -2880 512 -2912 528 2
LINE Normal -1376 1504 -1376 1296 2
LINE Normal -1408 1488 -1376 1504 2
LINE Normal -1344 1488 -1376 1504 2
LINE Normal -96 -448 -128 -432 2
LINE Normal -160 -448 -128 -432 2
LINE Normal -128 -432 -128 -640 2
LINE Normal -400 -160 -432 -144 2
LINE Normal -464 -160 -432 -144 2
LINE Normal -432 -144 -432 -352 2
LINE Normal -384 560 -416 576 2
LINE Normal -448 560 -416 576 2
LINE Normal -416 576 -416 368 2
LINE Normal -1200 -1008 -1200 -1216 2
LINE Normal -1232 -1024 -1200 -1008 2
LINE Normal -1168 -1024 -1200 -1008 2
RECTANGLE Normal 2448 -832 2080 -992
RECTANGLE Normal 2448 -656 2080 -800 3
RECTANGLE Normal 2800 -416 2464 -992 2
RECTANGLE Normal 2448 -416 1968 -640 3
RECTANGLE Normal 1968 -208 2800 -400 3
RECTANGLE Normal 2800 -1056 1744 -1552 4
RECTANGLE Normal 1712 -1312 1392 -1552 1
ARC Normal -32 -384 96 -288 -29 -382 0 -253 3
ARC Normal 48 560 -48 688 46 563 -83 592 3
ARC Normal -608 -240 -464 496 -563 485 -565 -235 2
ARC Normal -320 720 -400 864 -360 712 -364 870 2
ARC Normal -304 -624 -384 -448 -344 -632 -348 -442 2
ARC Normal -528 -704 -608 -816 -528 -685 -550 -816 2
ARC Normal -560 1056 -640 944 -560 1075 -582 944 2
ARC Normal -2384 -1392 -2304 -1216 -2340 -1210 -2344 -1400 2
ARC Normal -1024 -1376 -1104 -1200 -1064 -1384 -1068 -1194 2
ARC Normal -1056 1600 -1136 1424 -1100 1418 -1096 1608 2

The netlist it stands for:
* amplifier_V0.6_UGLY.asc
Q3 +HV N009 N010 0 MJE340
R3 N010 MID_POS 100
D3 VAD_POS N009 D1N4148
Q5 MID_POS N015 VBEI1 0 MJE340
R7 N016 feedback 0.25
R9 N021 VBEI1 100
R8 feedback N022 0.25
Q7 MID_NEG N025 VBEI2 0 MJE350
Q10 -HV N031 N030 0 MJE350
R6 MID_NEG N030 100
D4 N031 VAD_NEG D1N4148
D2 MID_NEG -LV MBR1645
R10 VBEI2 N021 100
R4 MID_NEG N029 0.1
R5 MID_NEG N028 0.1
R2 N011 MID_POS 0.1
R1 N012 MID_POS 0.1
D1 +LV MID_POS MBR1645
Q12 VBEM2 N018 N020 0 MJE350
Q11 VBEM1 N017 N020 0 MJE340
R18 VBEM1 N017 499
R19 N018 VBEM2 499
C3 VBEI1 VBEI2 {CComp1}
R13 N015 VBEM1 100
R16 N025 VBEM2 100
Q13 VAD_POS VAS_P_i N007 0 MPSA92
Q15 VAD_NEG VAS_N_i N033 0 MPSA42
C6 VBEM1 VBEM2 6.8n
Q16 0 N027 BUFF_N_o 0 MPSA42
R30 N006 N019 1.33k
R31 0 N006 35.7k
R42 N005 0 35.7k
C30 N019 0 2.2m
C31 N005 in 47µ
Q14 0 CQ34 BUFF_P_o 0 MPSA92
Q30 CQ34 N005 N008 0 MMPQ6700-NPN
Q31 CQ35 N006 N008 0 MMPQ6700-NPN
Q32 N027 N005 N032 0 MMPQ6700-PNP
Q33 N035 N006 N032 0 MMPQ6700-PNP
C4 VAD_POS CQ34 {CComp3}
C5 VAD_NEG N027 {CComp3}
Q35 CQ35 N001 EQ35 0 MMPQ6700-PNP
Q34 CQ34 N001 EQ34 0 MMPQ6700-PNP
Q37 N027 N038 N039 0 MMPQ6700-NPN
Q38 N035 N038 N040 0 MMPQ6700-NPN
R33 +9V EQ34 500
R32 +9V EQ35 500
R35 -9V N040 500
R36 -9V N039 500
Q39 +9V N035 N038 0 MMBTA42
Q36 -9V CQ35 N001 0 MMBTA92
R37 N038 -9V 50k
R34 +9V N001 50k
XQ2 +HV N010 N011 2SC5200  ; pins 2 1 3
XQ1 +HV N010 N012 2SC5200  ; pins 2 1 3
XQ4 MID_POS VBEI1 N016 2SC5200  ; pins 2 1 3
XQ6 MID_NEG VBEI2 N022 2SA1943  ; pins 2 1 3
XQ9 -HV N030 N028 2SA1943  ; pins 2 1 3
XQ8 -HV N030 N029 2SA1943  ; pins 2 1 3
R38 +9V N013 2k
Q40 N008 N013 N014 0 MMBTA42
R39 N014 -9V 844.6
Q41 N032 N024 N023 0 MMBTA92
R41 +9V N023 873.7
R40 N024 -9V 2k
RL feedback 0 {RL}
C2 N031 -HV {CComp2P}
C1 +HV N009 {CComp2N}
VG in 0 SINE(0 {VPin} {freq}) AC 1
D5 VBEM1 VAD_POS D1N4371
D6 VAD_NEG VBEM2 D1N4371
C40 +HV 0 220µ
C42 +LV 0 220µ
C43 -LV 0 220µ
C41 -HV 0 220µ
XD30 -9V N013 BZX84C5V1L  ; pins + -
XD31 N024 +9V BZX84C5V1L  ; pins + -
VPHV +HV 0 {PHV}
VPLV +LV 0 {PLV}
VNHV -HV 0 {NHV}
VNLV -LV 0 {NLV}
XRV1 N040 N039 -9V Rtot=10k wiper=0.4984
XRV2 EQ34 EQ35 +9V Rtot=10k wiper=0.5019
C7 0 N006 {CComp4}
Q18 VAS_P_i BQ18 N002 0 MPSA92
Q17 N004 BQ18 N003 0 MPSA92
R11 N004 N007 220
R12 +HV N003 {rpol2}
R20 +HV N002 {rpol1}
XRV3 N018 N017 N018 Rtot=5k wiper=0.16
R17 BQ18 0 4.3k
XD9 BQ18 +HV BZX84C5V1L  ; pins + -
C8 N004 0 22µ
R14 N033 N034 220
Q19 N034 BQ20 N037 0 MPSA42
R15 N037 -HV {rpol2}
Q20 VAS_N_i BQ20 N036 0 MPSA42
R21 N036 -HV {rpol1}
R22 BQ20 0 4.3k
XD10 -HV BQ20 BZX84C5V1L  ; pins + -
VNFS -9V 0 -9
VPFS +9V 0 9
V1 VAS_P_i BUFF_P_o {vtest}
V2 BUFF_N_o VAS_N_i {vtest}
V3 NC_01 0 6.64
V4 NC_02 0 -6.64
V5 N026 0 -1.6
C9 N034 0 22µ
.model D D
.lib standard.dio
.model NPN NPN
.model PNP PNP
.lib standard.bjt
* .tran 0 6m 1m 0.0001m
.param freq 1k
.op
.fourier {freq} 30 -1 V(out)
.lib 2SA1302.lib
.lib 2SC3281.lib
.lib D1N4371.lib
.lib MBR1645.lib
.lib MJE340.lib
.lib MJE350.lib
.lib D1N4148.lib
.lib MPSA42.lib
.lib MPSA92.lib
.lib D1N969.lib
* .ac dec 10000 0.01 10G
.param VPin=1
.lib BZX84C5V1.lib
.lib MMBTA42.lib
.lib MMBTA92.lib
.lib MMPQ6700.lib
.option plotwinsize=0
.meas TRAN Vrms RMS V(out)
.meas TRAN Pout PARAM (Vrms*Vrms/{RL})
.option numdgt=9
.meas TRAN Vout_max MAX V(out)
.param RL=8
.meas TRAN PinPHV AVG (V(+HV)*-I(VPHV))
.meas TRAN PinPLV AVG (V(+LV)*-I(VPLV))
.meas TRAN PinNHV AVG (V(-HV)*-I(VNHV))
.meas TRAN PinNLV AVG (V(-LV)*-I(VNLV))
.meas TRAN Pin param (PinPHV + PinPLV + PinNHV + PinNLV )
.meas TRAN Eff PARAM (Pout / Pin)
.param PHV={HV} PLV={LV} NHV=-{HV} NLV=-{LV}
.param HV=40.55
.param LV=15.94
.param CComp1=10n
.param CComp2N=100p
.param CComp3=120p
* Compensación
.param CComp2P=68p
.param CComp4=2.7p
.parm vtest=-7
.parm rpol1=1.47k
.parm rpol2=278
.lib 2SC5200.mod
.lib 2SA1943.mod
.backanno
.end